# Altium project RF Oscillator - R4.PrjPcb
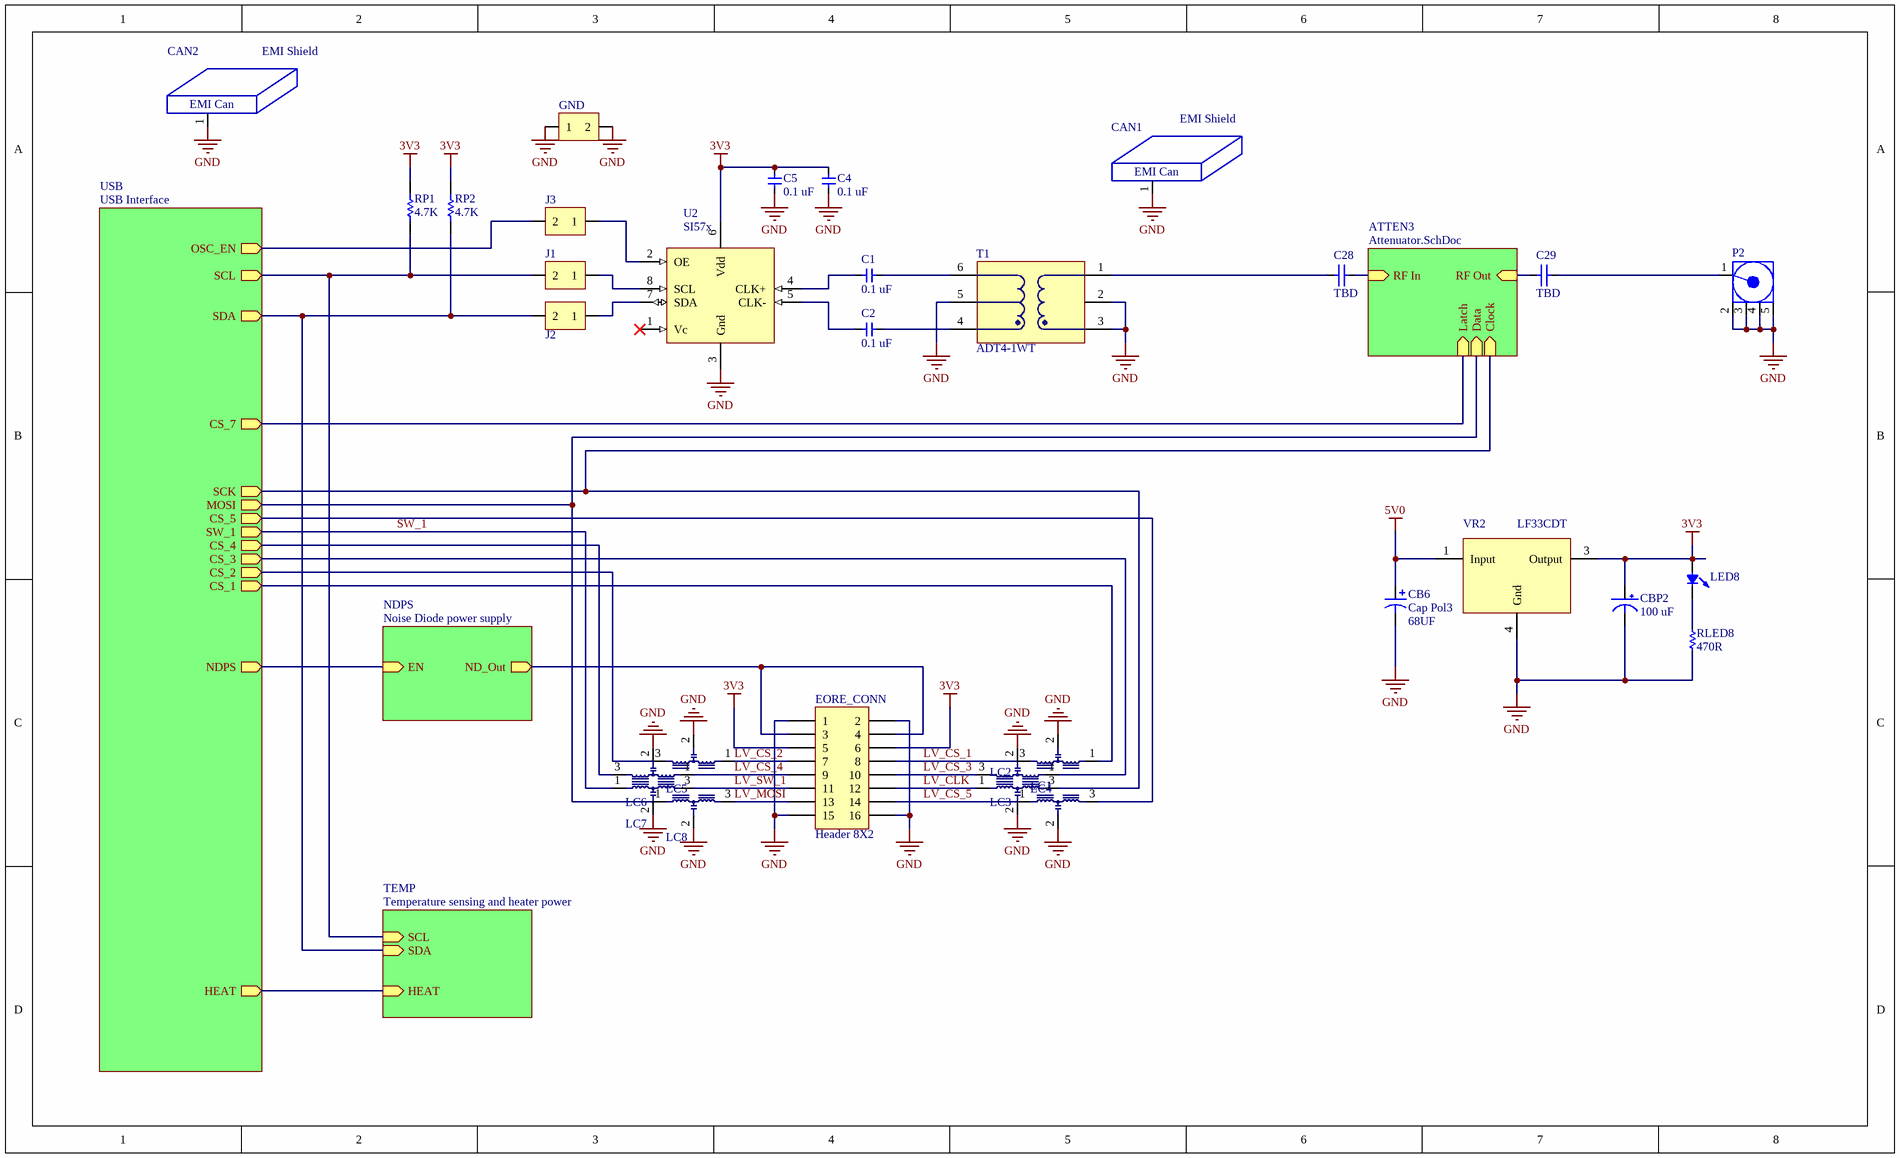
[diagram p0: Main.SchDoc]
4 sheets, 103 parts. Net scope: hierarchical (ports join the sheet entries above them; power ports are global).
Board file: Main.PcbDoc
Sheets:
  Main.SchDoc
    USB = USB Interface.SchDoc
    NDPS = Noise Diode power supply.SchDoc
    TEMP = Temperature sensing and heater power.SchDoc

## Sheet Main.SchDoc
size Legal

### Parts
C1  value 0.1 uF  [0603C]  (hidden comment: SMT Cap)
C2  value 0.1 uF  [0603C]  (hidden comment: SMT Cap)
C4  value 0.1 uF  [0603C]  (hidden comment: SMT Cap)
C5  value 0.1 uF  [0603C]  (hidden comment: SMT Cap)
C28  value TBD  [0402C]  (hidden comment: Cap)
C29  value TBD  [0402C]  (hidden comment: Cap)
CAN1  EMI Shield  [BMI-S-205-F]
CAN2  EMI Shield  [BMI-S-230-F-R]
CB6  Cap Pol3  value 68UF  [V]
CBP2  100 uF  [B]
EORE_CONN  Header 8X2  [SMT 16-pin rectangular header]
GND  Jumper  [HDR1X2]  (value not drawn)
J1  Jumper  [0603R]  (value not drawn)
J2  Jumper  [0603R]  (value not drawn)
J3  Jumper  [0603R]  (value not drawn)
LC1  MEM2012F  [MEM2012S LC Filter]  (value not drawn)
LC2  MEM2012F  [MEM2012S LC Filter]  (value not drawn)
LC3  MEM2012F  [MEM2012S LC Filter]  (value not drawn)
LC4  MEM2012F  [MEM2012S LC Filter]  (value not drawn)
LC5  MEM2012F  [MEM2012S LC Filter]  (value not drawn)
LC6  MEM2012F  [MEM2012S LC Filter]  (value not drawn)
LC7  MEM2012F  [MEM2012S LC Filter]  (value not drawn)
LC8  MEM2012F  [MEM2012S LC Filter]  (value not drawn)
LED8  LED0  [T1 LED]  (value not drawn)
P2  COAX-M  [SMA Jack - PCB Edge - MultiSize]  (value not drawn)
RLED8  value 470R  [0603R]  (hidden comment: Res Semi Small)
RP1  value 4.7K  [0603R]  (hidden comment: Res Semi)
RP2  value 4.7K  [0603R]  (hidden comment: Res Semi)
T1  ADT4-1WT  [CD542]
U2  SI57x  [SI57x]
VR2  LF33CDT  [TO228P1000-3_4N]

### Sub-sheets
ATTEN3 = Attenuator.SchDoc (file not in this document): RF In (in), RF Out (in), Clock (in), Data (in), Latch (in)
NDPS = Noise Diode power supply: EN (in), ND_Out (out)
TEMP = Temperature sensing and heater power: SCL (in), SDA (in), HEAT (in)
USB = USB Interface: SCL (out), SDA (out), SCK (out), MOSI (out), CS_1 (out), CS_2 (out), CS_3 (out), CS_4 (out), SW_1 (out), CS_5 (out), NDPS (out), OSC_EN (out), CS_7 (out), HEAT (out)

### Nets
3V3: C4.2 C5.2 CBP2.1 EORE_CONN.5 EORE_CONN.6 LED8.1 RP1.2 RP2.2 U2.6(Vdd) VR2.3(Output)
5V0: CB6.1 VR2.1(Input)
GND: C4.1 C5.1 CAN1.1 CAN2.1 CB6.2 CBP2.2 EORE_CONN.1 EORE_CONN.2 EORE_CONN.15 EORE_CONN.16 GND.1 GND.2 LC1.2 LC2.2 LC3.2 LC4.2 LC5.2 LC6.2 LC7.2 LC8.2 P2.2(GND) P2.3(GND) P2.4(GND) P2.5(GND) RLED8.2 T1.2(Gnd) T1.3(Coupled) T1.5(Termination) U2.3(Gnd) VR2.4(Gnd)
CS_1: LC4.1 ; sheet USB/CS_1
CS_2: LC5.3 ; sheet USB/CS_2
CS_3: LC3.1 ; sheet USB/CS_3
CS_4: LC6.3 ; sheet USB/CS_4
CS_5: LC1.3 ; sheet USB/CS_5
CS_7: sheet USB/CS_7, sheet ATTEN3/Latch
EN: sheet USB/NDPS, sheet NDPS/EN
HEAT: sheet USB/HEAT, sheet TEMP/HEAT
LV_CLK: EORE_CONN.12 LC2.1
LV_CS_1: EORE_CONN.8 LC4.3
LV_CS_2: EORE_CONN.7 LC5.1
LV_CS_3: EORE_CONN.10 LC3.3
LV_CS_4: EORE_CONN.9 LC6.1
LV_CS_5: EORE_CONN.14 LC1.1
LV_MOSI: EORE_CONN.13 LC8.3
LV_SW_1: EORE_CONN.11 LC7.3
MOSI: LC8.1 ; sheet USB/MOSI, sheet ATTEN3/Data
ND_Out: EORE_CONN.3 EORE_CONN.4 ; sheet NDPS/ND_Out
OSC_EN: J3.2 ; sheet USB/OSC_EN
SCK: LC2.3 ; sheet USB/SCK, sheet ATTEN3/Clock
SCL: J1.2 RP1.1 ; sheet USB/SCL, sheet TEMP/SCL
SDA: J2.2 RP2.1 ; sheet USB/SDA, sheet TEMP/SDA
SW_1: LC7.1 ; sheet USB/SW_1
NetC1_1: C1.1 U2.4(CLK+)
NetC1_2: C1.2 T1.6(Output)
NetC2_1: C2.1 U2.5(CLK-)
NetC2_2: C2.2 T1.4(Termination)
NetC28_1: C28.1 T1.1(Input)
NetC28_2: C28.2 ; sheet ATTEN3/RF In
NetC29_1: C29.1 ; sheet ATTEN3/RF Out
NetC29_2: C29.2 P2.1(Signal)
NetJ1_1: J1.1 U2.8(SCL)
NetJ2_1: J2.1 U2.7(SDA)
NetJ3_1: J3.1 U2.2(OE)
NetLED8_2: LED8.2 RLED8.1

Not connected (* = marked no-connect by the designer): U2 1(Vc)*

### Notes on the sheet
- (in symbol BMI-S-205-F RF/EMI Can) EMI Can
- (in symbol BMI-S-230-F-R RF/EMI Can) EMI Can

### Library data of the parts
C1 C2 C4 C5 = Cap - SMT Small: Published: 8-Jun-2000; LatestRevisionDate: 29-May-2009; LatestRevisionNote: IPC-7351 Footprint Added.; PackageReference: C1206; Publisher: Altium Limited; PackageDescription: Chip Capacitor
C28 C29 = Cap: Capacitor; Published: 8-Jun-2000; LatestRevisionDate: 17-Jul-2002; LatestRevisionNote: Re-released for DXP Platform.; PackageReference: RAD-0.3; Publisher: Altium Limited
CAN1 = BMI-S-205-F RF/EMI Can: Laird Technologies 2-part EMI can; DKPN: Base: 903-1054-1-ND Cover: 903-1017-ND
CAN2 = BMI-S-230-F-R RF/EMI Can: Laird Technologies 2-part EMI can; DKPN: Base: 903-1470-1-ND Cover: 903-1471-ND
CB6 = Cap Pol3: KEMET T520 KO-CAP  Polymer SMT Tantalum; DKPN: 399-3330-1-ND; Voltage: 10V; Type: KEMET T520 KO-CAP  Polymer SMT Tantalum
CBP2 = 100 uf SMT Panasonic Cap
EORE_CONN = Header 8X2: Header, 8-Pin, Dual row; LatestRevisionDate: 17-Jul-2002; LatestRevisionNote: Re-released for DXP Platform.; Publisher: Altium Limited
GND J1-J3 = Jumper - 2 Pin: Jumper - 2-Pin; LatestRevisionDate: 17-Jul-2002; LatestRevisionNote: Re-released for DXP Platform.; Publisher: Altium Limited
LC1-LC8 = MEM2012F - Signal Filter: Signal Line 3-terminal Filters
LED8 = LED0: T 1 3/4 LED; Published: 8-Jun-2000; LatestRevisionDate: 08-Jul-2005; LatestRevisionNote: Mech Layer 1 removed.; PackageReference: LED-0; Publisher: Altium Limited
P2 = COAX-M: RF Coaxial PCB Connector, MMCX; Thru-Hole, Vertical Mount Plug,  50 Ohm Impedance; PackageDocument: Rev. A, 16-Jun-1997; PCB_Layout: Complies with manufacturer's recommendation.; DrillSize: Corresponds to nominal value.; Published: 15-Jul-2004; LatestRevisionDate: 15-Jul-2004; LatestRevisionNote: Component Replaced.; DatasheetDocument: 30-May-2003; PackageReference: 908-21103; Publisher: Altium Limited; ComponentLink1Description: Manufacturer Link; ComponentLink1URL: http://www.amphenolrf.com/
RLED8 = Res Semi Small: Semiconductor Resistor; Published: 8-Jun-2000; LatestRevisionDate: 17-Jul-2002; LatestRevisionNote: Re-released for DXP Platform.; PackageReference: AXIAL-0.5; Publisher: Altium Limited
RP1 RP2 = Res Semi: Semiconductor Resistor; Published: 8-Jun-2000; LatestRevisionDate: 17-Jul-2002; LatestRevisionNote: Re-released for DXP Platform.; PackageReference: AXIAL-0.5; Publisher: Altium Limited
T1 = ADT4-1WT: Surface Mount RF Transformer
U2 = SI570: 10 MHZ TO 1.4 GHZ I2C PROGRAMMABLE XO/VCXO
VR2 = LF33CDT: Very low drop 500 ma voltage regulators; DKPN: 497-1532-1-ND

## Sheet USB Interface.SchDoc
size Tabloid
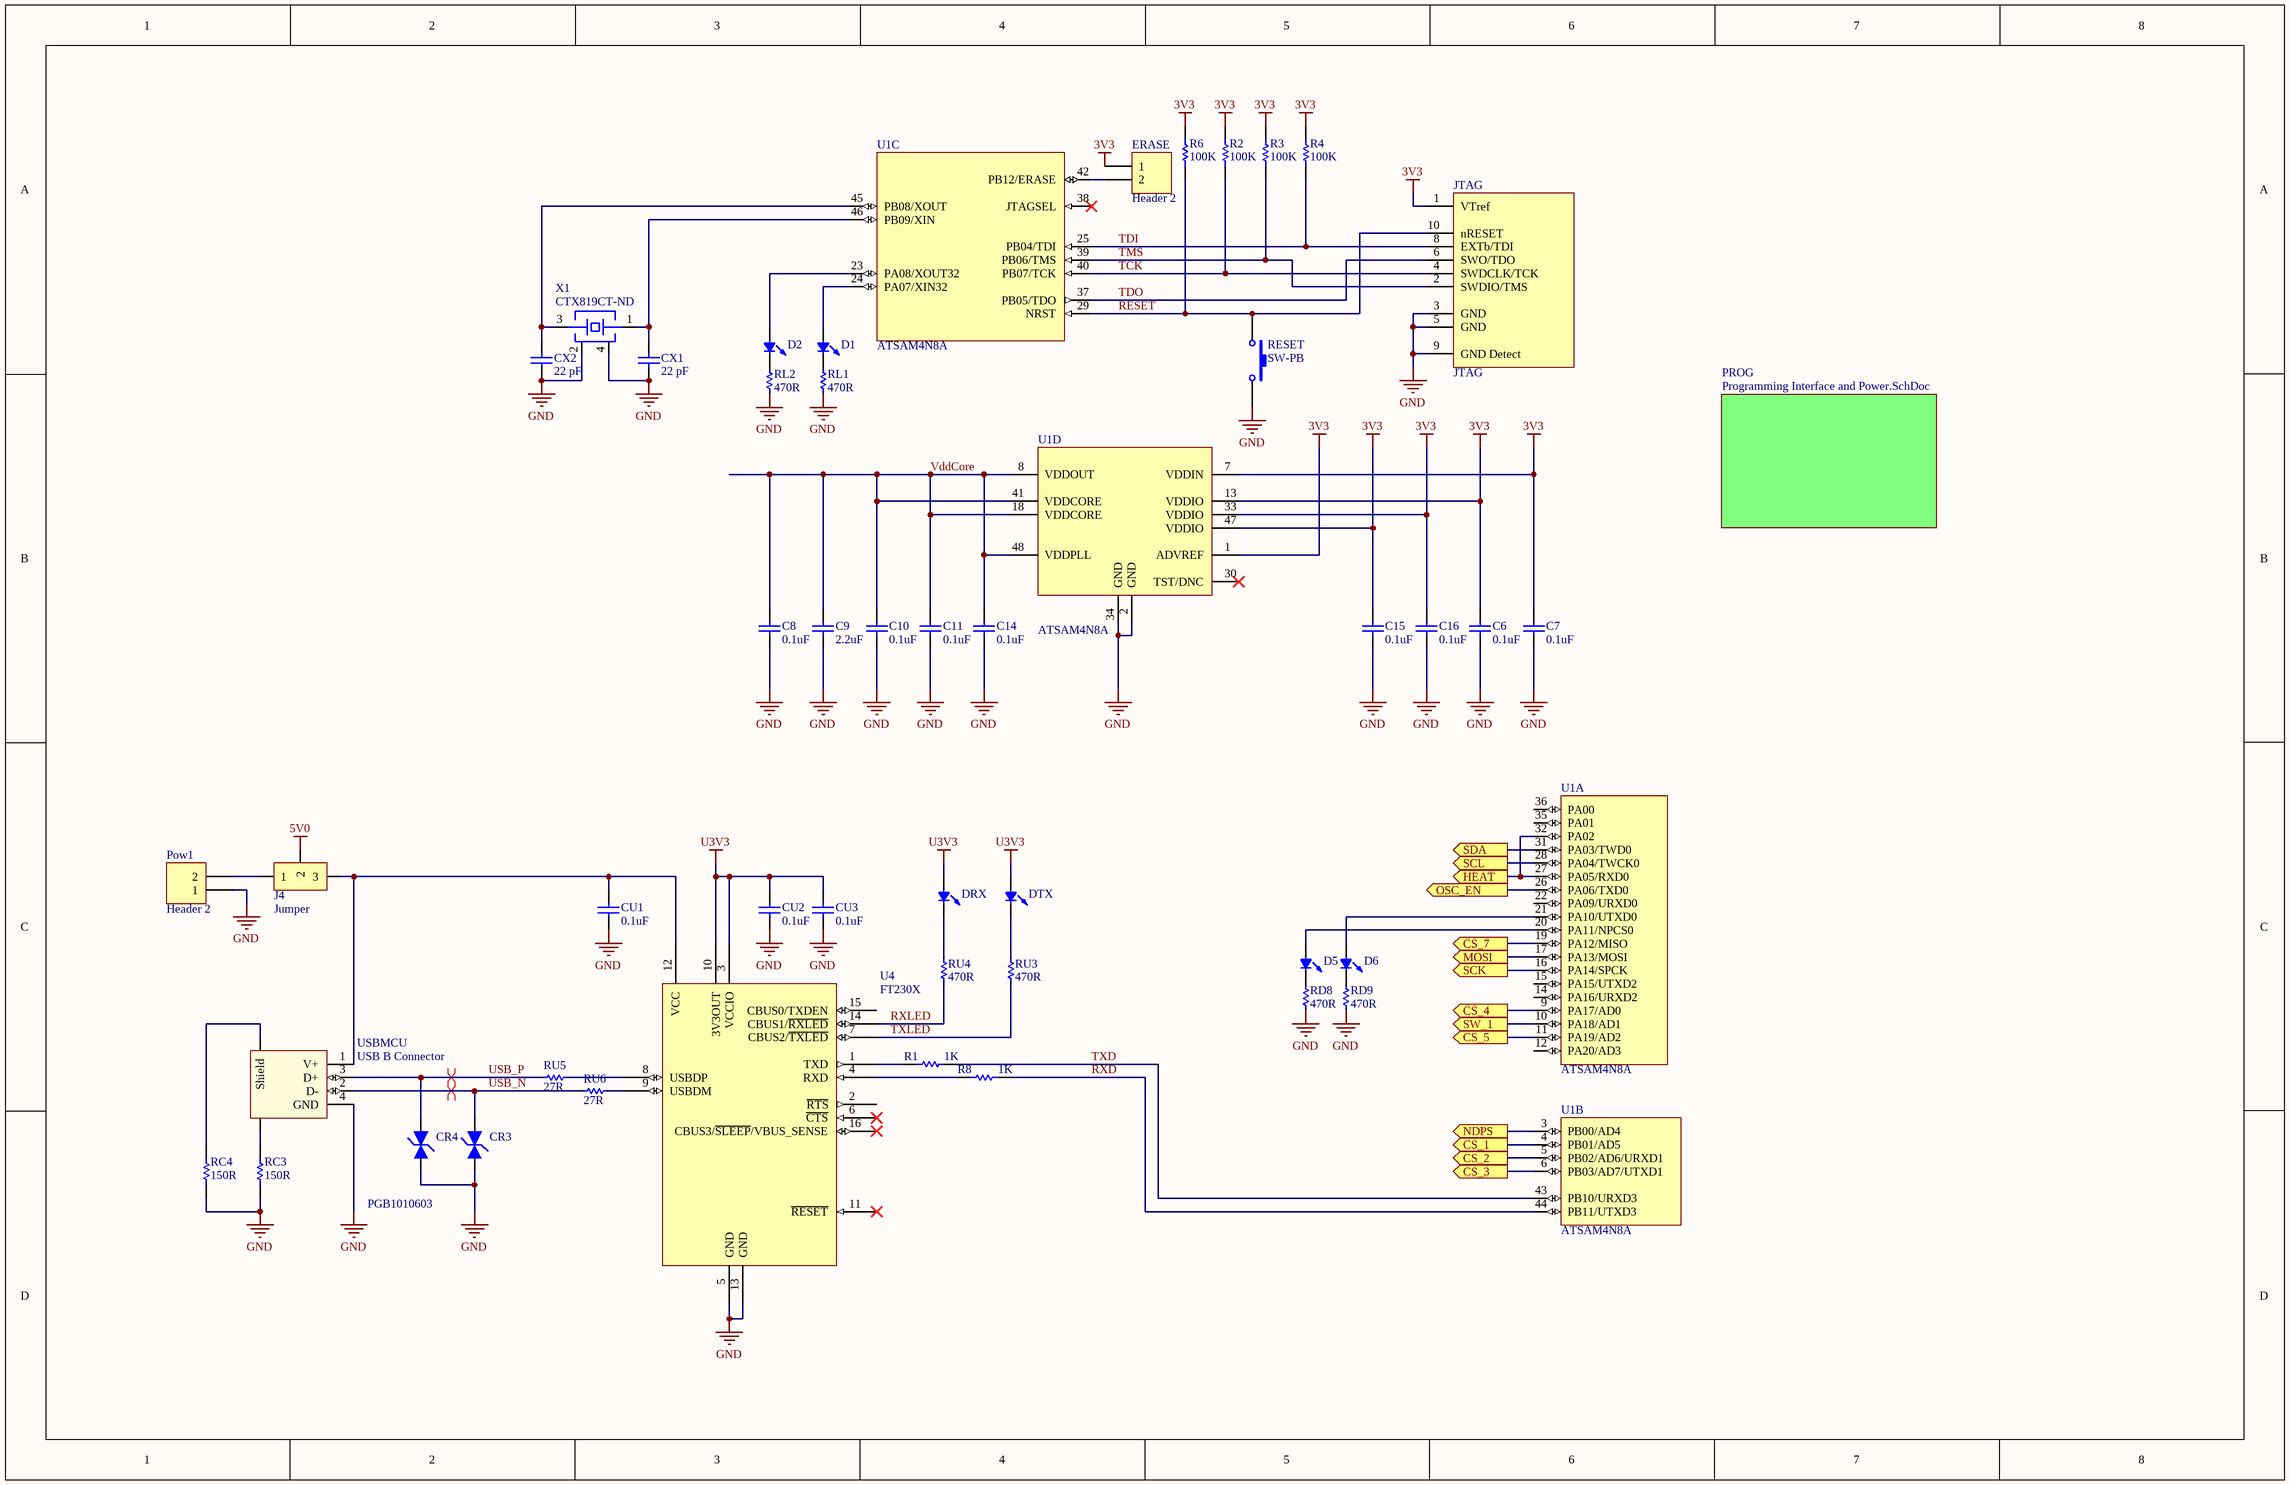
[diagram p1: USB Interface.SchDoc]

### Parts
C6  value 0.1uF  [0603C]  (hidden comment: Cap Semi)
C7  value 0.1uF  [0603C]  (hidden comment: Cap Semi)
C8  value 0.1uF  [0603C]  (hidden comment: Cap Semi)
C9  value 2.2uF  [1206C]  (hidden comment: Cap Semi)
C10  value 0.1uF  [0603C]  (hidden comment: Cap Semi)
C11  value 0.1uF  [0603C]  (hidden comment: Cap Semi)
C14  value 0.1uF  [0603C]  (hidden comment: Cap Semi)
C15  value 0.1uF  [0603C]  (hidden comment: Cap Semi)
C16  value 0.1uF  [0603C]  (hidden comment: Cap Semi)
CR3  PGB1010603  [0603PG]  (value not drawn)
CR4  PGB1010603  [0603PG]
CU1  value 0.1uF  [0603C]  (hidden comment: Cap Semi)
CU2  value 0.1uF  [0603C]  (hidden comment: Cap Semi)
CU3  value 0.1uF  [0603C]  (hidden comment: Cap Semi)
CX1  value 22 pF  [0603C]  (hidden comment: Cap Semi)
CX2  value 22 pF  [0603C]  (hidden comment: Cap Semi)
D1  LED0  [T1 LED]  (value not drawn)
D2  LED0  [T1 LED]  (value not drawn)
D5  LED0  [T1 LED]  (value not drawn)
D6  LED0  [T1 LED]  (value not drawn)
DRX  LED0  [T1 LED]  (value not drawn)
DTX  LED0  [T1 LED]  (value not drawn)
ERASE  Header 2  [HDR1X2]
J4  Jumper  [HDR1X3]
JTAG  JTAG  [MHDR2X5]
Pow1  Header 2  [AMPModu MTE 2 Pin Right Angle PCB-Locking Shrouded Header]
R1  value 1K  [0603R]  (hidden comment: Res Semi)
R2  value 100K  [0603R]  (hidden comment: Res Semi)
R3  value 100K  [0603R]  (hidden comment: Res Semi)
R4  value 100K  [0603R]  (hidden comment: Res Semi)
R6  value 100K  [0603R]  (hidden comment: Res Semi)
R8  value 1K  [0603R]  (hidden comment: Res Semi)
RC3  value 150R  [1206R]  (hidden comment: Res Semi)
RC4  value 150R  [1206R]  (hidden comment: Res Semi)
RD8  value 470R  [0603R]  (hidden comment: Res Semi Small)
RD9  value 470R  [0603R]  (hidden comment: Res Semi Small)
RESET  SW-PB  [TL3302BF180QG/TR]
RL1  value 470R  [0603R]  (hidden comment: Res Semi Small)
RL2  value 470R  [0603R]  (hidden comment: Res Semi Small)
RU3  value 470R  [0603R]  (hidden comment: Res Semi Small)
RU4  value 470R  [0603R]  (hidden comment: Res Semi Small)
RU5  value 27R  [0603R]  (hidden comment: Res Semi Small)
RU6  value 27R  [0603R]  (hidden comment: Res Semi Small)
U1  ATSAM4N8A  [TSQFP50P900X900-48N]  (parts A,B,C,D of 4)
U4  FT230X  [SOP635P600-16AN]
USBMCU  USB B Connector  [USB Connector (type B)]
X1  CTX819CT-ND  [Abracon ABM3B Crystal]

### Sub-sheets
PROG = Programming Interface and Power.SchDoc (file not in this document): no entries

### Ports
CS_1 (out), CS_2 (out), CS_3 (out), CS_4 (out), CS_5 (out), CS_7 (out), HEAT (out), MOSI (out), NDPS (out), OSC_EN (out), SCK (out), SCL (out), SDA (out), SW_1 (out)

### Nets
3V3: C6.2 C7.2 C15.2 C16.2 ERASE.1 JTAG.1(VTref) R2.2 R3.2 R4.2 R6.2 U1.1(ADVREF) U1.7(VDDIN) U1.13(VDDIO) U1.33(VDDIO) U1.47(VDDIO)
5V0: J4.2
GND: C6.1 C7.1 C8.1 C9.1 C10.1 C11.1 C14.1 C15.1 C16.1 CR3.2 CR4.2 CU1.1 CU2.1 CU3.1 CX1.1 CX2.1 JTAG.3(GND) JTAG.5(GND) JTAG.9(GND_Detect) Pow1.1 RC3.1 RC4.1 RD8.2 RD9.2 RESET.2 RL1.2 RL2.2 U1.2(GND) U1.34(GND) U4.5(GND) U4.13(GND) USBMCU.4(GND) X1.2 X1.4
U3V3: CU2.2 CU3.2 DRX.1 DTX.1 U4.3(VCCIO) U4.10(3V3OUT)
CS_1: U1.4(PB01/AD5) ; port CS_1
CS_2: U1.5(PB02/AD6/URXD1) ; port CS_2
CS_3: U1.6(PB03/AD7/UTXD1) ; port CS_3
CS_4: U1.9(PA17/AD0) ; port CS_4
CS_5: U1.11(PA19/AD2) ; port CS_5
CS_7: U1.19(PA12/MISO) ; port CS_7
EN: U1.3(PB00/AD4) ; port NDPS
HEAT: U1.27(PA05/RXD0) U1.32(PA02) ; port HEAT
MOSI: U1.17(PA13/MOSI) ; port MOSI
OSC_EN: U1.26(PA06/TXD0) ; port OSC_EN
RESET: JTAG.10(nRESET) R6.1 RESET.1 U1.29(NRST)
RXD: R8.2 U1.44(PB11/UTXD3)
RXLED: RU4.2 U4.14(CBUS1/~{RXLED})
SCK: U1.16(PA14/SPCK) ; port SCK
SCL: U1.28(PA04/TWCK0) ; port SCL
SDA: U1.31(PA03/TWD0) ; port SDA
SW_1: U1.10(PA18/AD1) ; port SW_1
TCK: JTAG.4(SWDCLK/TCK) R2.1 U1.40(PB07/TCK)
TDI: JTAG.8(EXTb/TDI) R4.1 U1.25(PB04/TDI)
TDO: JTAG.6(SWO/TDO) U1.37(PB05/TDO)
TMS: JTAG.2(SWDIO/TMS) R3.1 U1.39(PB06/TMS)
TXD: R1.2 U1.43(PB10/URXD3)
TXLED: RU3.2 U4.7(CBUS2/~{TXLED})
USB_N: CR3.1 RU6.1 USBMCU.2(D-)
USB_P: CR4.1 RU5.1 USBMCU.3(D+)
VddCore: C8.2 C9.2 C10.2 C11.2 C14.2 U1.8(VDDOUT) U1.18(VDDCORE) U1.41(VDDCORE) U1.48(VDDPLL)
NetCU1_2: CU1.2 J4.3 U4.12(VCC) USBMCU.1(V+)
NetCX1_2: CX1.2 U1.46(PB09/XIN) X1.1
NetCX2_2: CX2.2 U1.45(PB08/XOUT) X1.3
NetD1_1: D1.1 U1.24(PA07/XIN32)
NetD1_2: D1.2 RL1.1
NetD2_1: D2.1 U1.23(PA08/XOUT32)
NetD2_2: D2.2 RL2.1
NetD5_1: D5.1 U1.20(PA11/NPCS0)
NetD5_2: D5.2 RD8.1
NetD6_1: D6.1 U1.21(PA10/UTXD0)
NetD6_2: D6.2 RD9.1
NetDRX_2: DRX.2 RU4.1
NetDTX_2: DTX.2 RU3.1
NetERASE_2: ERASE.2 U1.42(PB12/ERASE)
NetJ4_1: J4.1 Pow1.2
NetR1_1: R1.1 U4.1(TXD)
NetR8_1: R8.1 U4.4(RXD)
NetRC3_2: RC3.2 USBMCU.5(Gnd)
NetRC4_2: RC4.2 USBMCU.6(Shield)
NetRU5_2: RU5.2 U4.8(NC)
NetRU6_2: RU6.2 U4.9(USBDM)

Not connected (* = marked no-connect by the designer): U1 12(PA20/AD3) 14(PA16/URXD2) 15(PA15/UTXD2) 22(PA09/URXD0) 30(TST/DNC)* 35(PA01) 36(PA00) 38(JTAGSEL)*; U4 2(~{RTS}) 6(~{CTS})* 11(~{RESET})* 15(CBUS0/TXDEN) 16(CBUS3/~{SLEEP}/VBUS_SENSE)* 24(NC)

### Layout directives
differential pair: USB_N, USB_P

### Library data of the parts
C6-C11 C14-C16 CU1-CU3 CX1 CX2 = Cap Semi: Capacitor (Semiconductor SIM Model); Published: 8-Jun-2000; LatestRevisionDate: 17-Jul-2002; LatestRevisionNote: Re-released for DXP Platform.; PackageReference: C1206; Publisher: Altium Limited
CR3 CR4 = PGB1010603: PulseGuard® Lead-Free 0603 Surface Mount Polymeric ESD Suppressors
D1 D2 D5 D6 DRX DTX = LED0: T 1 3/4 LED; Published: 8-Jun-2000; LatestRevisionDate: 08-Jul-2005; LatestRevisionNote: Mech Layer 1 removed.; PackageReference: LED-0; Publisher: Altium Limited
ERASE Pow1 = Header 2: Header, 2-Pin; LatestRevisionDate: 17-Jul-2002; LatestRevisionNote: Re-released for DXP Platform.; Publisher: Altium Limited
J4 = Jumper - 3 Pin: Jumper - 3-Pin; LatestRevisionDate: 17-Jul-2002; LatestRevisionNote: Re-released for DXP Platform.; Publisher: Altium Limited
JTAG = ARM JTAG-10: ARM 10-Pin JTAG Interface
R1-R4 R6 R8 RC3 RC4 = Res Semi: Semiconductor Resistor; Published: 8-Jun-2000; LatestRevisionDate: 17-Jul-2002; LatestRevisionNote: Re-released for DXP Platform.; PackageReference: AXIAL-0.5; Publisher: Altium Limited
RD8 RD9 RL1 RL2 RU3-RU6 = Res Semi Small: Semiconductor Resistor; Published: 8-Jun-2000; LatestRevisionDate: 17-Jul-2002; LatestRevisionNote: Re-released for DXP Platform.; PackageReference: AXIAL-0.5; Publisher: Altium Limited
RESET = SW-PB: Switch; Published: 24-Mar-1999; LatestRevisionDate: 17-Jul-2002; LatestRevisionNote: Re-released for DXP Platform.; PackageReference: SPST-2; Publisher: Altium Limited
U1 = ATSAM4N8A: SAM4N ARM Cortex-M4 Microcontrollers
U4 = FT230X: USB To Basic Serial Bridge IC; DKPN: 768-1135-1-ND; Datasheet: http://www.ftdichip.com/Support/Documents/DataSheets/ICs/DS_FT230X.pdf
USBMCU = USB B connector - Through hole
X1 = SMT Crystal: 16 MHz Micro SMT Crystal; DKPN: 535-9122-1-ND; MFGPN: ABM3B-16.000MHZ-B2-T; DKDESC: CRYSTAL 16.000MHZ 18PF SMD

## Sheet Noise Diode power supply.SchDoc
size A
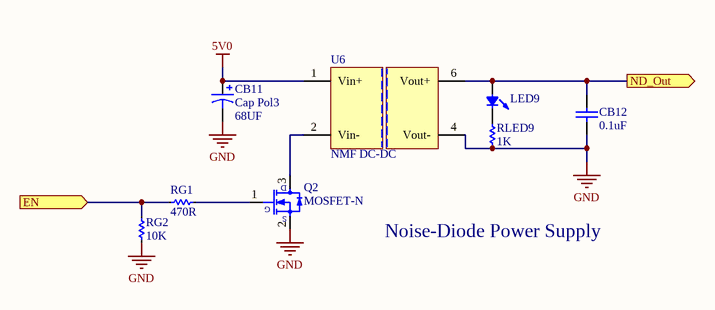
[diagram p2: Noise Diode power supply.SchDoc]

### Parts
CB11  Cap Pol3  value 68UF  [V]
CB12  value 0.1uF  [0603C]  (hidden comment: Cap Semi)
LED9  LED0  [T1 LED]  (value not drawn)
Q2  MOSFET-N  [SOT23-3N]
RG1  value 470R  [0603R]  (hidden comment: Res Semi Small)
RG2  value 10K  [0603R]  (hidden comment: Res Semi Small)
RLED9  value 1K  [0603R]  (hidden comment: Res Semi Small)
U6  NMF DC-DC  [SIL-6(A1)]

### Ports
EN (in), ND_Out (out)

### Nets
5V0: CB11.1 U6.1(Vin+)
GND: CB11.2 CB12.1 Q2.2(S) RG2.1 RLED9.2 U6.4(Vout-)
EN: RG1.1 RG2.2 ; port EN
ND_Out: CB12.2 LED9.1 U6.6(Vout+) ; port ND_Out
NetLED9_2: LED9.2 RLED9.1
NetQ2_1: Q2.1(G) RG1.2
NetQ2_3: Q2.3(D) U6.2(Vin-)

### Notes on the sheet
- Noise-Diode Power Supply

### Library data of the parts
CB11 = Cap Pol3: as CB6 on sheet Main; Type: KEMET T520 KO-CAP  Polymer SMT Tantalum
CB12 = Cap Semi: Capacitor (Semiconductor SIM Model); Published: 8-Jun-2000; LatestRevisionDate: 17-Jul-2002; LatestRevisionNote: Re-released for DXP Platform.; PackageReference: C1206; Publisher: Altium Limited
LED9 = LED0: T 1 3/4 LED; Published: 8-Jun-2000; LatestRevisionDate: 08-Jul-2005; LatestRevisionNote: Mech Layer 1 removed.; PackageReference: LED-0; Publisher: Altium Limited
Q2 = MOSFET-N: N-Channel MOSFET; Published: 8-Jun-2000; LatestRevisionDate: 17-Jul-2002; LatestRevisionNote: Re-released for DXP Platform.; PackageVersion: 1995/1996; PackageReference: E3; Publisher: Altium Limited
RG1 RG2 RLED9 = Res Semi Small: Semiconductor Resistor; Published: 8-Jun-2000; LatestRevisionDate: 17-Jul-2002; LatestRevisionNote: Re-released for DXP Platform.; PackageReference: AXIAL-0.5; Publisher: Altium Limited
U6 = Murata NMF DC-DC: Murata NMF DC-DC - 1W, Single output

## Sheet Temperature sensing and heater power.SchDoc
size A
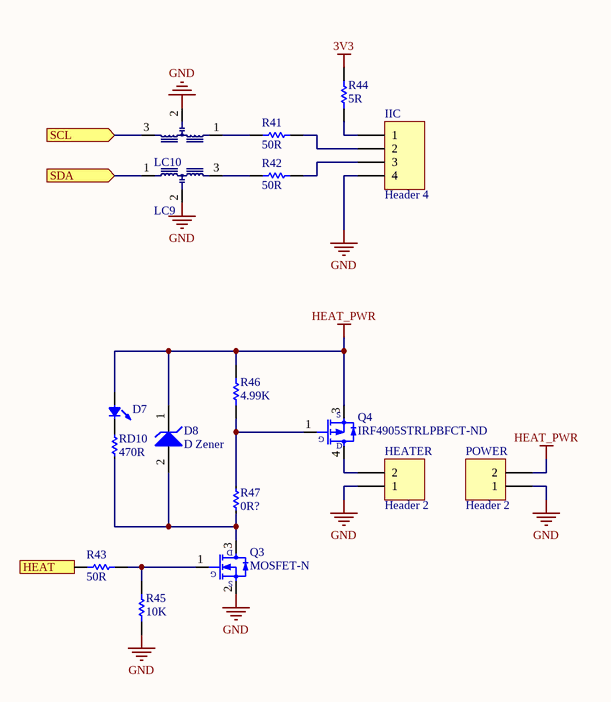
[diagram p3: Temperature sensing and heater power.SchDoc]

### Parts
D7  LED0  [T1 LED]  (value not drawn)
D8  D Zener  [SOD123/X.85]
HEATER  Header 2  [Molex Mini-Fit Jr 5569 - 2 Pin, RA]
IIC  Header 4  [AMPModu MTE 4 Pin Shrouded Header]
LC9  MEM2012F  [MEM2012S LC Filter]  (value not drawn)
LC10  MEM2012F  [MEM2012S LC Filter]  (value not drawn)
POWER  Header 2  [Molex Mini-Fit Jr 5569 - 2 Pin, RA]
Q3  MOSFET-N  [SOT23-3N]
Q4  IRF4905STRLPBFCT-ND  [TO254P1520-3_4N]
R41  value 50R  [0603R]  (hidden comment: Res Semi)
R42  value 50R  [0603R]  (hidden comment: Res Semi)
R43  value 50R  [0603R]  (hidden comment: Res Semi)
R44  value 5R  [1206R]  (hidden comment: Res Semi)
R45  value 10K  [0603R]  (hidden comment: Res Semi)
R46  value 4.99K  [1206R]  (hidden comment: Res Semi)
R47  value 0R?  [0603R]  (hidden comment: Res Semi Small)
RD10  value 470R  [0603R]  (hidden comment: Res Semi Small)

### Ports
HEAT (in), SCL (in), SDA (in)

### Nets
3V3: R44.2
GND: HEATER.1 IIC.4 LC9.2 LC10.2 POWER.1 Q3.2(S) R45.1
HEAT_PWR: D7.1 D8.1(A) POWER.2 Q4.3(D) R46.2
HEAT: R43.1 ; port HEAT
SCL: LC10.3 ; port SCL
SDA: LC9.1 ; port SDA
NetD7_2: D7.2 RD10.1
NetD8_2: D8.2(K) Q3.3(D) R47.2 RD10.2
NetHEATER_2: HEATER.2 Q4.4(S)
NetIIC_1: IIC.1 R44.1
NetIIC_2: IIC.2 R41.2
NetIIC_3: IIC.3 R42.2
NetLC9_3: LC9.3 R42.1
NetLC10_1: LC10.1 R41.1
NetQ3_1: Q3.1(G) R43.2 R45.2
NetQ4_1: Q4.1(G) R46.1 R47.1

### Library data of the parts
D7 = LED0: T 1 3/4 LED; Published: 8-Jun-2000; LatestRevisionDate: 08-Jul-2005; LatestRevisionNote: Mech Layer 1 removed.; PackageReference: LED-0; Publisher: Altium Limited
D8 = D Zener: Zener Diode; Published: 8-Jun-2000; LatestRevisionDate: 17-Jul-2002; LatestRevisionNote: Re-released for DXP Platform.; PackageReference: DIODE-0.7; Publisher: Altium Limited
HEATER POWER = Header 2: Header, 2-Pin; LatestRevisionDate: 17-Jul-2002; LatestRevisionNote: Re-released for DXP Platform.; Publisher: Altium Limited
IIC = Header 4: Header, 4-Pin; LatestRevisionDate: 17-Jul-2002; LatestRevisionNote: Re-released for DXP Platform.; Publisher: Altium Limited
LC9 LC10 = MEM2012F - Signal Filter: Signal Line 3-terminal Filters
Q3 = MOSFET-N: N-Channel MOSFET; Published: 8-Jun-2000; LatestRevisionDate: 17-Jul-2002; LatestRevisionNote: Re-released for DXP Platform.; PackageVersion: 1995/1996; PackageReference: E3; Publisher: Altium Limited
Q4 = MOSFET-P: P-Channel MOSFET; Published: 8-Jun-2000; LatestRevisionDate: 17-Jul-2002; LatestRevisionNote: Re-released for DXP Platform.; PackageVersion: 1995/1996; PackageReference: E3; Publisher: Altium Limited
R41-R46 = Res Semi: Semiconductor Resistor; Published: 8-Jun-2000; LatestRevisionDate: 17-Jul-2002; LatestRevisionNote: Re-released for DXP Platform.; PackageReference: AXIAL-0.5; Publisher: Altium Limited
R47 RD10 = Res Semi Small: Semiconductor Resistor; Published: 8-Jun-2000; LatestRevisionDate: 17-Jul-2002; LatestRevisionNote: Re-released for DXP Platform.; PackageReference: AXIAL-0.5; Publisher: Altium Limited

## Nets that join several sheets
3V3: Main (10 pins), USB Interface (15 pins), Temperature sensing and heater power (R44.2)
5V0: Main (CB6.1 VR2.1), USB Interface (J4.2), Noise Diode power supply (CB11.1 U6.1)
GND: Main (30 pins), USB Interface (34 pins), Noise Diode power supply (6 pins), Temperature sensing and heater power (7 pins)
CS_1: Main (LC4.1), USB Interface (U1.4)
CS_2: Main (LC5.3), USB Interface (U1.5)
CS_3: Main (LC3.1), USB Interface (U1.6)
CS_4: Main (LC6.3), USB Interface (U1.9)
CS_5: Main (LC1.3), USB Interface (U1.11)
EN: USB Interface (U1.3), Noise Diode power supply (RG1.1 RG2.2)
HEAT: USB Interface (U1.27 U1.32), Temperature sensing and heater power (R43.1)
MOSI: Main (LC8.1), USB Interface (U1.17)
ND_Out: Main (EORE_CONN.3 EORE_CONN.4), Noise Diode power supply (CB12.2 LED9.1 U6.6)
OSC_EN: Main (J3.2), USB Interface (U1.26)
SCK: Main (LC2.3), USB Interface (U1.16)
SCL: Main (J1.2 RP1.1), USB Interface (U1.28), Temperature sensing and heater power (LC10.3)
SDA: Main (J2.2 RP2.1), USB Interface (U1.31), Temperature sensing and heater power (LC9.1)
SW_1: Main (LC7.1), USB Interface (U1.10)